# Altium schematic sheet 09-LogicNOR.SchDoc
size A4; DocumentNumber: 9; SheetNumber: 9; SheetTotal: 26
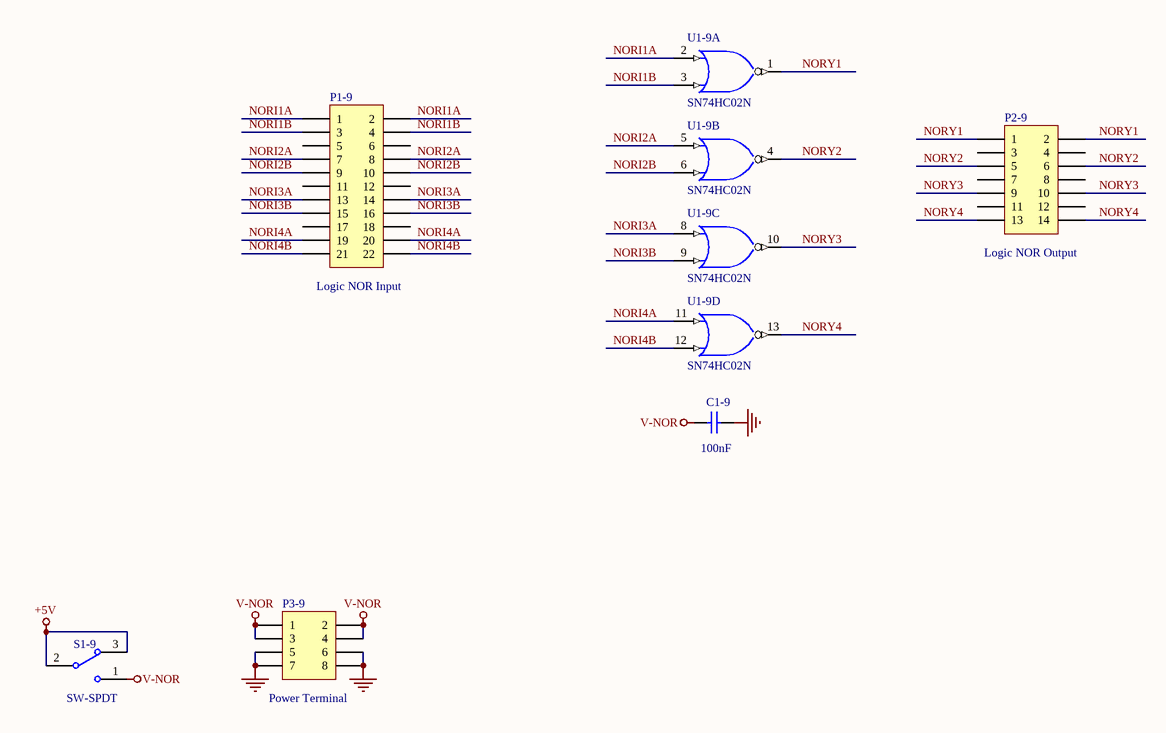
[diagram p0: 09-LogicNOR.SchDoc]

## Parts
C1-9  value 100nF  [c-0805]  (hidden comment: 104)
P1-9  value Logic NOR Input  [JP2.54-F-2x11A]  (hidden comment: Header 11X2)
P2-9  value Logic NOR Output  [JP2.54-F-2x07A]  (hidden comment: H7X2)
P3-9  Publisher: Power Terminal  [JP2.54-F-2x04A]  (hidden comment: Header 4X2)
S1-9  SW-SPDT  [SW-SLIDE-2P-2W]
U1-9  SN74HC02N  [SK-DIP14-300]  (parts A,B,C,D of 4)

## Nets
+5V: S1-9.2 S1-9.3
GND: C1-9.2 P3-9.5 P3-9.6 P3-9.7 P3-9.8 U1-9.7(GND)
V-NOR: C1-9.1 P3-9.1 P3-9.2 P3-9.3 P3-9.4 S1-9.1
VCC: U1-9.14(V-NOR)
NORI1A: P1-9.1 P1-9.2 U1-9.2(A)
NORI1B: P1-9.3 P1-9.4 U1-9.3(B)
NORI2A: P1-9.7 P1-9.8 U1-9.5(A)
NORI2B: P1-9.9 P1-9.10 U1-9.6(B)
NORI3A: P1-9.13 P1-9.14 U1-9.8(A)
NORI3B: P1-9.15 P1-9.16 U1-9.9(B)
NORI4A: P1-9.19 P1-9.20 U1-9.11(A)
NORI4B: P1-9.21 P1-9.22 U1-9.12(B)
NORY1: P2-9.1 P2-9.2 U1-9.1(Y)
NORY2: P2-9.5 P2-9.6 U1-9.4(Y)
NORY3: P2-9.9 P2-9.10 U1-9.10(Y)
NORY4: P2-9.13 P2-9.14 U1-9.13(Y)

Not connected (* = marked no-connect by the designer): P1-9 5 6 11 12 17 18; P2-9 3 4 7 8 11 12

## Library data of the parts
C1-9 = Cap: Capacitor; Published: 8-Jun-2000; LatestRevisionDate: 17-Jul-2002; LatestRevisionNote: Re-released for DXP Platform.; PackageReference: RAD-0.3; Publisher: Altium Limited; PackageDescription: Radial Cap, Thru-Hole; 2 Leads; 0.3 in Pin Spacing
P1-9 = Header 11X2: Header, 11-Pin, Dual row; LatestRevisionDate: 17-Jul-2002; LatestRevisionNote: Re-released for DXP Platform.
P2-9 = Header 7X2: Header, 7-Pin, Dual row; LatestRevisionDate: 17-Jul-2002; LatestRevisionNote: Re-released for DXP Platform.
P3-9 = Header 4X2: Header, 4-Pin, Dual row; LatestRevisionDate: 17-Jul-2002; LatestRevisionNote: Re-released for DXP Platform.
S1-9 = SW-SPDT: SPDT Subminiature Toggle Switch, Right Angle Mounting, Vertical Actuation; Published: 24-Mar-1999; LatestRevisionDate: 17-Dec-2003; LatestRevisionNote: Schematic revised, PCB Footprint replaced.; DatasheetVersion: 05-Dec-2000; PackageReference: TL36WW15050; Publisher: Altium Limited; PackageDescription: Switch; 4 Leads; ComponentLink1Description: Manufacturer Link; ComponentLink1URL: http://www.apem.com
U1-9 = SN74HC02N: Quadruple 2-Input Positive-NOR Gate; Published: 8-Jun-2000; LatestRevisionDate: 04-Mar-2005; LatestRevisionNote: Stylized 3D Model Added.; DatasheetVersion: May-1997; PackageVersion: Oct-1995; PackageReference: N014; Publisher: Altium Limited; PackageDescription: DIP; 14 Leads; Row Spacing 7.62 mm; Pitch 2.54 mm; ComponentLink1Description: Manufacturer Link; ComponentLink1URL: http://www.ti.com/; ComponentLink2Description: Datasheet; ComponentLink2URL: http://www-s.ti.com/sc/ds/sn74hc02.pdf